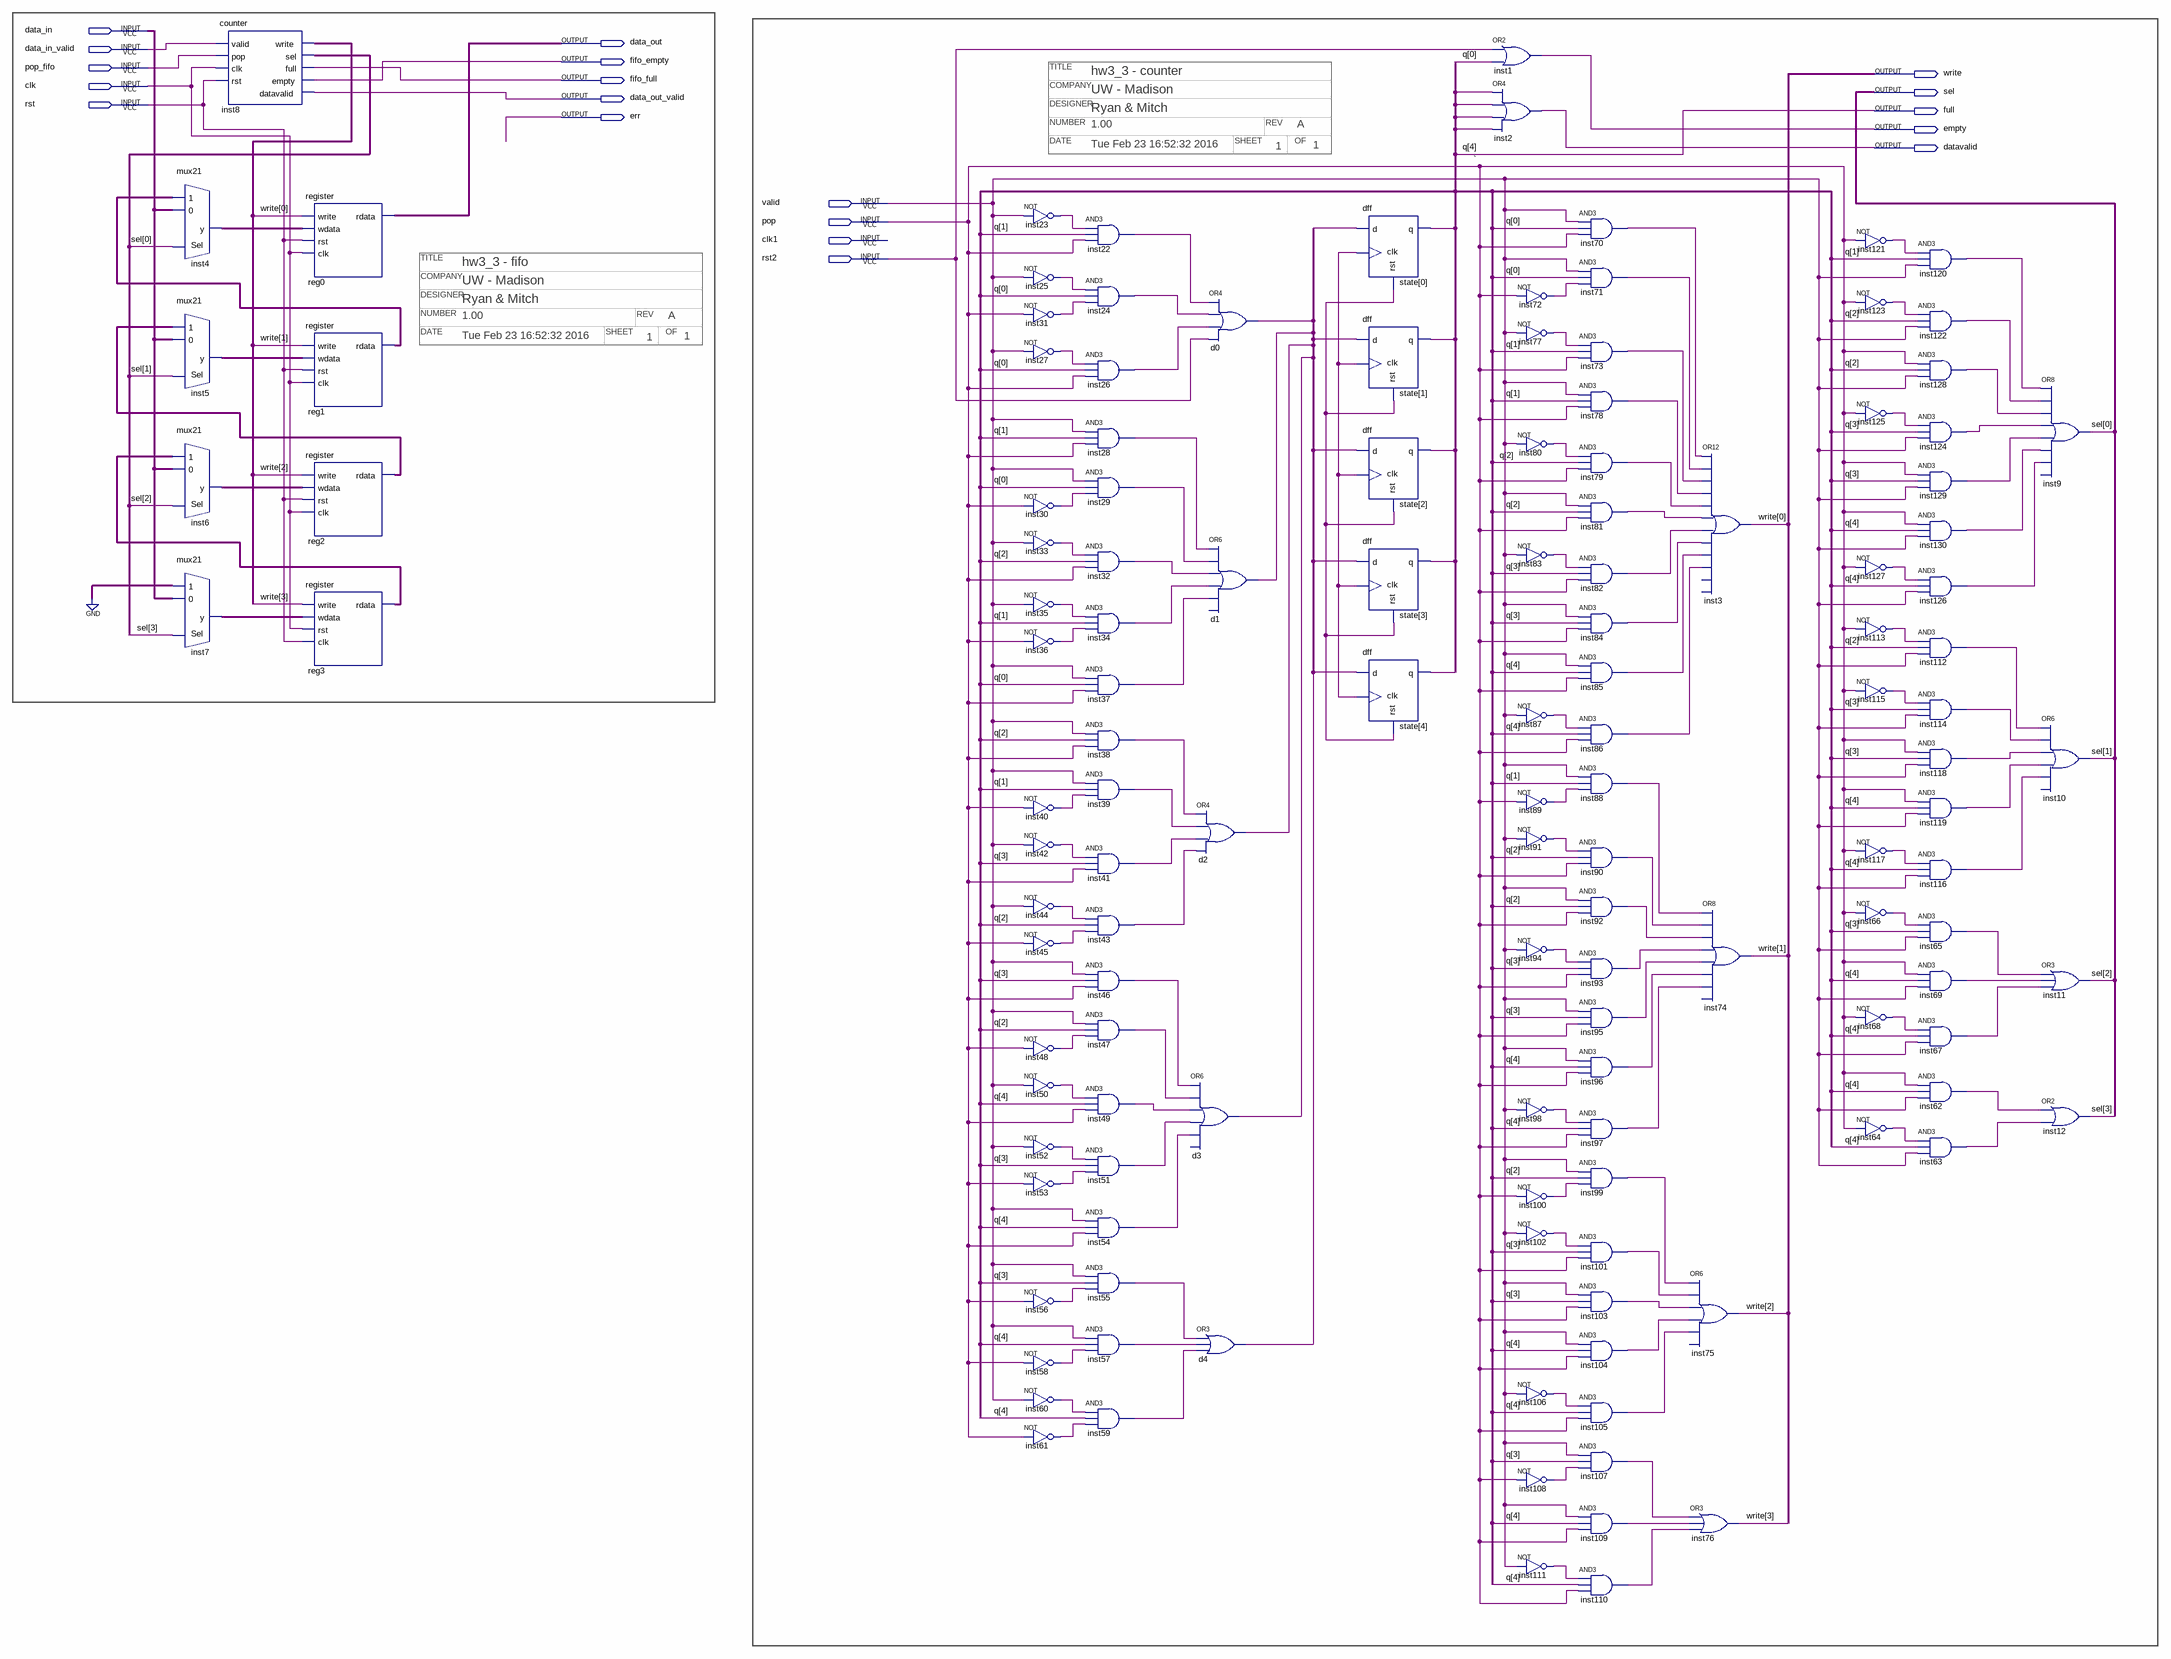
[diagram p0: schematic sheet]
// Quartus schematic fifo.bdf as structural Verilog: 135 symbols, 19 pins
// Title block: TITLE: hw3_3 - fifo; COMPANY: UW - Madison; DESIGNER: Ryan & Mitch; NUMBER: 1.00; REV: A; DATE: Tue Feb 23 16:52:32 2016; SHEET: 1; OF: 1
// Title block: TITLE: hw3_3 - counter; COMPANY: UW - Madison; DESIGNER: Ryan & Mitch; NUMBER: 1.00; REV: A; DATE: Tue Feb 23 16:52:32 2016; SHEET: 1; OF: 1
module fifo (
  input  data_in,
  input  data_in_valid,
  input  pop_fifo,
  input  clk,
  input  rst,
  input  valid,
  input  pop,
  input  clk1,
  input  rst2,
  output data_out,
  output fifo_empty,
  output write,
  output fifo_full,
  output sel,
  output data_out_valid,
  output full,
  output err,
  output empty,
  output datavalid
);

  wire d0_out, inst4_y, inst5_y, inst6_y, inst7_y, inst8_sel, inst8_write, inst22_out, inst23_out,
       inst24_out, inst25_out, inst26_out, inst27_out, inst28_out, inst29_out, inst30_out, inst31_out,
       inst32_out, inst33_out, inst34_out, inst35_out, inst36_out, inst37_out, inst38_out, inst39_out,
       inst40_out, inst41_out, inst42_out, inst43_out, inst44_out, inst45_out, inst46_out, inst47_out,
       inst48_out, inst49_out, inst50_out, inst51_out, inst52_out, inst53_out, inst54_out, inst55_out,
       inst56_out, inst57_out, inst58_out, inst59_out, inst60_out, inst61_out, inst62_out, inst63_out,
       inst64_out, inst65_out, inst66_out, inst67_out, inst68_out, inst69_out, inst70_out, inst71_out,
       inst72_out, inst73_out, inst77_out, inst78_out, inst79_out, inst80_out, inst81_out, inst82_out,
       inst83_out, inst84_out, inst85_out, inst86_out, inst87_out, inst88_out, inst89_out, inst90_out,
       inst91_out, inst92_out, inst93_out, inst94_out, inst95_out, inst96_out, inst97_out, inst98_out,
       inst99_out, inst100_out, inst101_out, inst102_out, inst103_out, inst104_out, inst105_out, inst106_out,
       inst107_out, inst108_out, inst109_out, inst110_out, inst111_out, inst112_out, inst113_out,
       inst114_out, inst115_out, inst116_out, inst117_out, inst118_out, inst119_out, inst120_out,
       inst121_out, inst122_out, inst123_out, inst124_out, inst125_out, inst126_out, inst127_out,
       inst128_out, inst129_out, inst130_out, reg1_rdata, reg2_rdata, reg3_rdata, state_0__q, undriven,
       undriven_2;
  wire [3:0] q, sel_bus, write_bus;

  mux21 inst4 (.Sel(sel_bus[0]), .\0 (data_in), .\1 (reg1_rdata), .y(inst4_y));
  mux21 inst5 (.Sel(sel_bus[1]), .\0 (data_in), .\1 (reg2_rdata), .y(inst5_y));
  mux21 inst6 (.Sel(sel_bus[2]), .\0 (data_in), .\1 (reg3_rdata), .y(inst6_y));
  mux21 inst7 (.Sel(sel_bus[3]), .\0 (data_in), .\1 (1'b0), .y(inst7_y));
  counter inst8 (
    .valid(data_in_valid), .pop(pop_fifo), .clk(clk), .rst(rst), .write(inst8_write), .sel(inst8_sel),
    .full(fifo_full), .empty(fifo_empty), .datavalid(data_out_valid));
  register reg0 (.write(write_bus[0]), .wdata(inst4_y), .rst(rst), .clk(clk), .rdata(data_out));
  register reg1 (.write(write_bus[1]), .wdata(inst5_y), .rst(rst), .clk(clk), .rdata(reg1_rdata));
  register reg2 (.write(write_bus[2]), .wdata(inst6_y), .rst(rst), .clk(clk), .rdata(reg2_rdata));
  register reg3 (.write(write_bus[3]), .wdata(inst7_y), .rst(clk), .clk(rst), .rdata(reg3_rdata));
  not inst23 (inst23_out, valid);
  not inst25 (inst25_out, valid);
  not inst31 (inst31_out, pop);
  not inst27 (inst27_out, valid);
  not inst30 (inst30_out, pop);
  not inst33 (inst33_out, valid);
  not inst35 (inst35_out, valid);
  not inst36 (inst36_out, pop);
  not inst40 (inst40_out, pop);
  not inst42 (inst42_out, valid);
  not inst44 (inst44_out, valid);
  not inst45 (inst45_out, pop);
  not inst48 (inst48_out, pop);
  not inst50 (inst50_out, valid);
  not inst52 (inst52_out, valid);
  not inst53 (inst53_out, pop);
  not inst56 (inst56_out, pop);
  not inst58 (inst58_out, pop);
  not inst60 (inst60_out, valid);
  not inst61 (inst61_out, pop);
  and inst22 (inst22_out, inst23_out, q[1], pop);
  and inst24 (inst24_out, inst25_out, q[0], inst31_out);
  and inst26 (inst26_out, inst27_out, q[0], pop);
  and inst28 (inst28_out, valid, q[1], pop);
  and inst29 (inst29_out, valid, q[0], inst30_out);
  and inst32 (inst32_out, inst33_out, q[2], pop);
  and inst34 (inst34_out, inst35_out, q[1], inst36_out);
  and inst37 (inst37_out, valid, q[0], pop);
  and inst38 (inst38_out, valid, q[2], pop);
  and inst39 (inst39_out, valid, q[1], inst40_out);
  and inst41 (inst41_out, inst42_out, q[3], pop);
  and inst43 (inst43_out, inst44_out, q[2], inst45_out);
  and inst46 (inst46_out, valid, q[3], pop);
  and inst47 (inst47_out, valid, q[2], inst48_out);
  and inst49 (inst49_out, inst50_out, full, pop);
  and inst51 (inst51_out, inst52_out, q[3], inst53_out);
  and inst54 (inst54_out, valid, full, pop);
  and inst55 (inst55_out, valid, q[3], inst56_out);
  and inst57 (inst57_out, valid, full, inst58_out);
  and inst59 (inst59_out, inst60_out, full, inst61_out);
  or d0 (d0_out, inst22_out, inst24_out, inst26_out, rst2);
  or d1 (d0_out, inst28_out, inst29_out, inst32_out, inst34_out, inst37_out);  // open: IN6
  or d2 (d0_out, inst38_out, inst39_out, inst41_out, inst43_out);
  or d3 (d0_out, inst46_out, inst47_out, inst49_out, inst51_out, inst54_out);  // open: IN6
  or d4 (d0_out, inst55_out, inst57_out, inst59_out);
  dff \state[0]  (.d(d0_out), .clk(undriven), .rst(undriven_2), .q(state_0__q));
  dff \state[1]  (.d(d0_out), .clk(undriven), .rst(undriven_2), .q(state_0__q));
  dff \state[2]  (.d(d0_out), .clk(undriven), .rst(undriven_2), .q(state_0__q));
  dff \state[3]  (.d(d0_out), .clk(undriven), .rst(undriven_2), .q(state_0__q));
  dff \state[4]  (.d(d0_out), .clk(undriven), .rst(undriven_2), .q(state_0__q));
  or inst1 (empty, rst2, q[0]);
  or inst2 (datavalid, state_0__q, state_0__q, state_0__q, state_0__q);
  not inst72 (inst72_out, pop);
  not inst77 (inst77_out, valid);
  not inst80 (inst80_out, valid);
  not inst83 (inst83_out, valid);
  not inst87 (inst87_out, valid);
  not inst89 (inst89_out, pop);
  not inst91 (inst91_out, valid);
  not inst94 (inst94_out, valid);
  not inst98 (inst98_out, valid);
  not inst100 (inst100_out, pop);
  not inst102 (inst102_out, valid);
  not inst106 (inst106_out, valid);
  not inst108 (inst108_out, pop);
  not inst111 (inst111_out, valid);
  and inst70 (inst70_out, valid, q[0], pop);
  and inst71 (inst71_out, valid, q[0], inst72_out);
  and inst73 (inst73_out, inst77_out, q[1], pop);
  and inst78 (inst78_out, valid, q[1], pop);
  and inst79 (inst79_out, inst80_out, q[2], pop);
  and inst81 (inst81_out, valid, q[2], pop);
  and inst82 (inst82_out, inst83_out, q[3], pop);
  and inst84 (inst84_out, valid, q[3], pop);
  and inst85 (inst85_out, valid, full, pop);
  and inst86 (inst86_out, inst87_out, full, pop);
  and inst88 (inst88_out, valid, q[1], inst89_out);
  and inst90 (inst90_out, inst91_out, q[2], pop);
  and inst92 (inst92_out, valid, q[2], pop);
  and inst93 (inst93_out, inst94_out, q[3], pop);
  and inst95 (inst95_out, valid, q[3], pop);
  and inst96 (inst96_out, valid, full, pop);
  and inst97 (inst97_out, inst98_out, full, pop);
  and inst99 (inst99_out, valid, q[2], inst100_out);
  and inst101 (inst101_out, inst102_out, q[3], pop);
  and inst103 (inst103_out, valid, q[3], pop);
  and inst104 (inst104_out, valid, full, pop);
  and inst105 (inst105_out, inst106_out, full, pop);
  and inst107 (inst107_out, valid, q[3], inst108_out);
  and inst109 (inst109_out, valid, full, pop);
  and inst110 (inst110_out, inst111_out, full, pop);
  or inst3 (write_bus[0], inst70_out, inst71_out, inst73_out, inst78_out, inst79_out, inst81_out, inst82_out, inst84_out, inst85_out, inst86_out);  // open: IN11, IN12
  or inst74 (write_bus[1], inst88_out, inst90_out, inst92_out, inst93_out, inst95_out, inst96_out, inst97_out);  // open: IN8
  or inst75 (write_bus[2], inst99_out, inst101_out, inst103_out, inst104_out, inst105_out);  // open: IN6
  or inst76 (write_bus[3], inst107_out, inst109_out, inst110_out);
  not inst121 (inst121_out, pop);
  not inst123 (inst123_out, pop);
  not inst125 (inst125_out, pop);
  not inst127 (inst127_out, pop);
  not inst113 (inst113_out, pop);
  not inst115 (inst115_out, pop);
  not inst117 (inst117_out, pop);
  not inst66 (inst66_out, pop);
  not inst68 (inst68_out, pop);
  not inst64 (inst64_out, pop);
  and inst120 (inst120_out, inst121_out, q[1], valid);
  and inst122 (inst122_out, inst123_out, q[2], valid);
  and inst128 (inst128_out, pop, q[2], valid);
  and inst124 (inst124_out, inst125_out, q[3], valid);
  and inst129 (inst129_out, pop, q[3], valid);
  and inst130 (inst130_out, pop, full, valid);
  and inst126 (inst126_out, inst127_out, full, valid);
  and inst112 (inst112_out, inst113_out, q[2], valid);
  and inst114 (inst114_out, inst115_out, q[3], valid);
  and inst118 (inst118_out, pop, q[3], valid);
  and inst119 (inst119_out, pop, full, valid);
  and inst116 (inst116_out, inst117_out, full, valid);
  and inst65 (inst65_out, inst66_out, q[3], valid);
  and inst69 (inst69_out, pop, full, valid);
  and inst67 (inst67_out, inst68_out, full, valid);
  and inst62 (inst62_out, pop, full, valid);
  and inst63 (inst63_out, inst64_out, full, valid);
  or inst9 (sel_bus[0], inst120_out, inst122_out, inst128_out, inst124_out, inst129_out, inst130_out, inst126_out);  // open: IN8
  or inst10 (sel_bus[1], inst112_out, inst114_out, inst118_out, inst119_out, inst116_out);  // open: IN6
  or inst11 (sel_bus[2], inst65_out, inst69_out, inst67_out);
  or inst12 (sel_bus[3], inst62_out, inst63_out);

  // Other names for the same wires on the sheet: q[4] = full; ` = pop
endmodule
